# EAGLE schematic RealSignalDemonstrator (EAGLE 7.7.0)
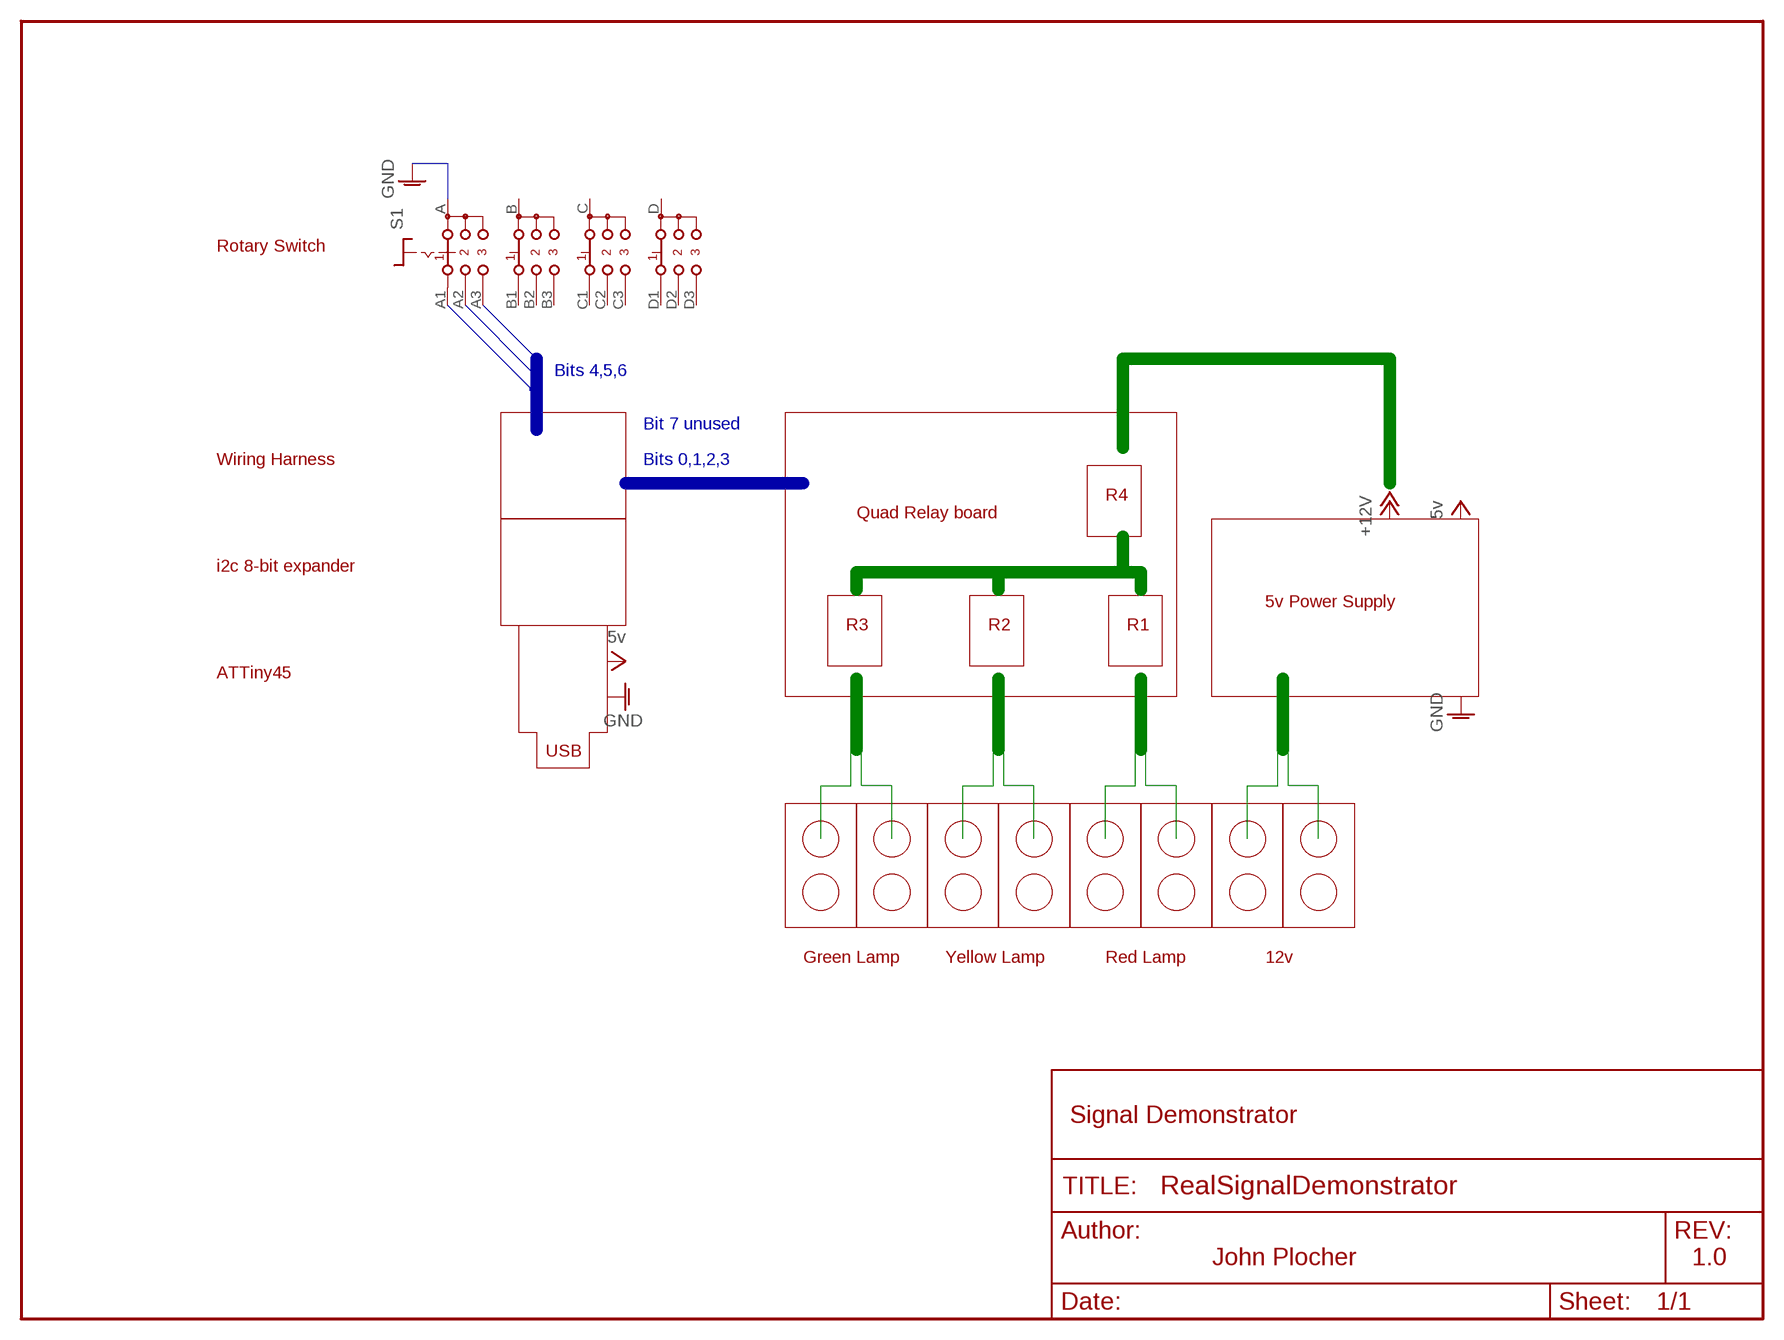
[diagram p0: schematic, sheet 1]

## Parts
S1  CK104X03  [CK104X03]
Unconnected: S1.A S1.A1 S1.A2 S1.A3 S1.B S1.B1 S1.B2 S1.B3 S1.C S1.C1 S1.C2 S1.C3 S1.D S1.D1 S1.D2 S1.D3

## Buses
B$1
B$2
B$3
B$4
B$5

## Notes on the sheet
- Rotary Switch
- Bits 4,5,6
- Bit 7 unused
- Wiring Harness | Bits 0,1,2,3
- R4
- Quad Relay board
- i2c 8-bit expander
- 5v Power Supply
- R3 | R2 | R1
- ATTiny45
- USB
- Green Lamp | Yellow Lamp | Red Lamp | 12v
- Signal Demonstrator
- John Plocher | 1.0

## Library data of the parts
S1 = switch:CK104X03: ROTARY SWITCH C&K